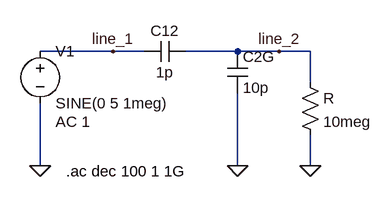
[diagram p0: schematic LM741_4.asc]
LM741_4.asc, the LTspice schematic file:
Version 4
SHEET 1 880 680
WIRE 96 112 -16 112
WIRE 144 112 96 112
WIRE 288 112 208 112
WIRE 352 112 288 112
WIRE 400 112 352 112
WIRE 400 160 400 112
WIRE -16 288 -16 192
WIRE 288 288 288 176
WIRE 400 288 400 240
FLAG -16 288 0
FLAG 288 288 0
FLAG 400 288 0
FLAG 96 112 line_1
FLAG 352 112 line_2
SYMBOL voltage -16 96 R0
WINDOW 123 24 124 Left 2
WINDOW 39 0 0 Left 2
SYMATTR Value2 AC 1
SYMATTR InstName V1
SYMATTR Value SINE(0 5 1meg)
SYMBOL cap 272 112 R0
SYMATTR InstName C2G
SYMATTR Value 10p
SYMBOL cap 208 96 R90
WINDOW 0 0 32 VBottom 2
WINDOW 3 32 32 VTop 2
SYMATTR InstName C12
SYMATTR Value 1p
SYMBOL res 384 144 R0
SYMATTR InstName R
SYMATTR Value 10meg
TEXT 24 296 Left 2 !.ac dec 100 1 1G

The netlist it stands for:
* LM741_4.asc
V1 line_1 0 SINE(0 5 1meg) AC 1
C2G line_2 0 10p
C12 line_2 line_1 1p
R line_2 0 10meg
.ac dec 100 1 1G
.backanno
.end